# EAGLE design monster_dac (EAGLE 6.4)

## Sheet 1 of 3: DAC
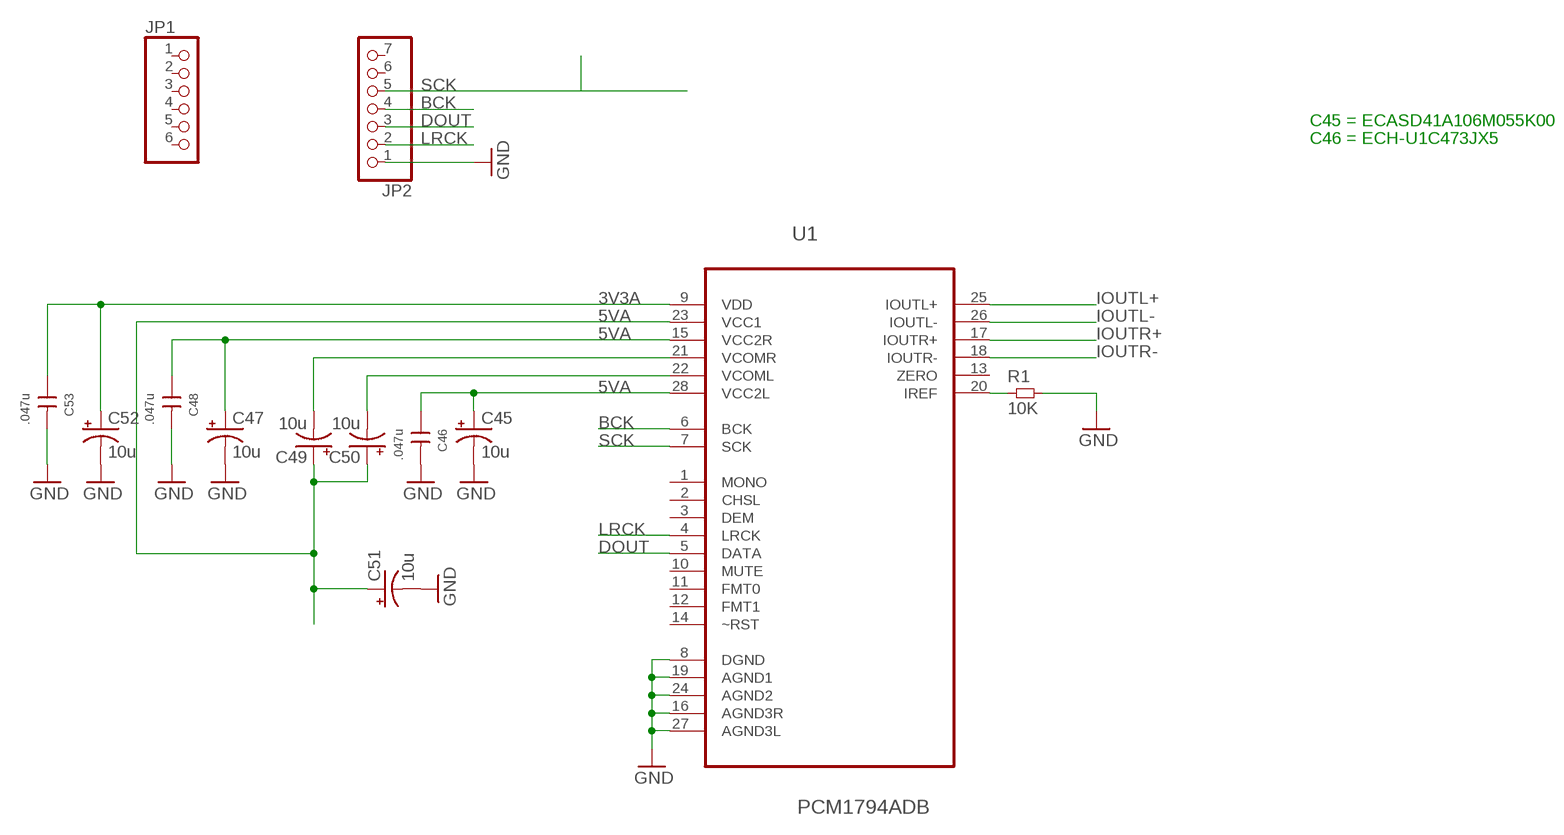
[diagram p0: schematic, sheet 1]

### Parts
C45  10u  CPOL-USE2-5  [E2-5]
C46  .047u  47NF63VMKS2  [2,5X6,5RM5,0]
C47  10u  CPOL-USE2-5  [E2-5]
C48  .047u  47NF63VMKS2  [2,5X6,5RM5,0]
C49  10u  CPOL-USE2-5  [E2-5]
C50  10u  CPOL-USE2-5  [E2-5]
C51  10u  CPOL-USE2-5  [E2-5]
C52  10u  CPOL-USE2-5  [E2-5]
C53  .047u  47NF63VMKS2  [2,5X6,5RM5,0]
JP1  PINHD-1X6  [1X06]
JP2  PINHD-1X7  [1X07]
R1  10K  RES0603L3  [0603L3]
U1  PCM1794ADB  [SOP65P780X200-28N]

### Nets
3V3A: C52.+ C53.1 U1.9(VDD)
5VA: C45.+ C46.1 C47.+ C48.1 C49.+ C50.+ C51.+ U1.15(VCC2R) U1.23(VCC1) U1.28(VCC2L)
BCK: JP2.4 U1.6(BCK)
DOUT: JP2.3 U1.5(DATA)
GND: C45.- C46.2 C47.- C48.2 C51.- C52.- C53.2 JP2.1 R1.P$2 U1.8(DGND) U1.16(AGND3R) U1.19(AGND1) U1.24(AGND2) U1.27(AGND3L) ; also sheet 2,3
IOUTL+: U1.25(IOUTL+) ; also sheet 2
IOUTL-: U1.26(IOUTL-) ; also sheet 2
IOUTR+: U1.17(IOUTR+) ; also sheet 2
IOUTR-: U1.18(IOUTR-) ; also sheet 2
LRCK: JP2.2 U1.4(LRCK)
N$2: R1.P$1 U1.20(IREF)
N$3: C50.- U1.22(VCOML)
N$4: C49.- U1.21(VCOMR)
SCK: JP2.5 U1.7(SCK)
Unconnected: JP1.1 JP1.2 JP1.3 JP1.4 JP1.5 JP1.6 JP2.6 JP2.7 U1.1(MONO) U1.2(CHSL) U1.3(DEM) U1.10(MUTE) U1.11(FMT0) U1.12(FMT1) U1.13(ZERO) U1.14(~RST)

### Notes on the sheet
- C45 = ECASD41A106M055K00
- C46 = ECH-U1C473JX5

## Sheet 2 of 3: I/V Converter
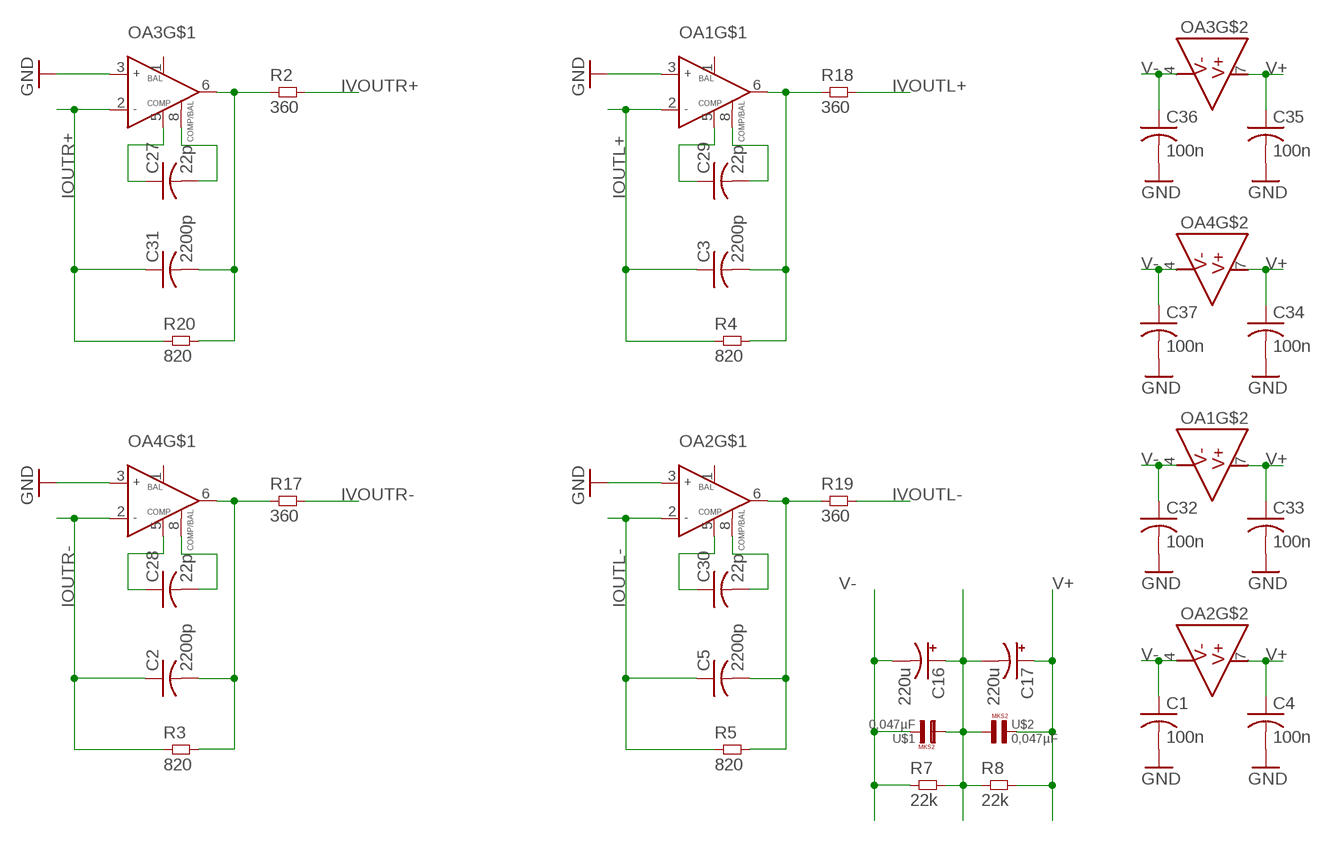
[diagram p1: schematic, sheet 2]

### Parts
C1  100n  C-USC0603  [C0603]
C2  2200p  C-USC0603  [C0603]
C3  2200p  C-USC0603  [C0603]
C4  100n  C-USC0603  [C0603]
C5  2200p  C-USC0603  [C0603]
C16  220u  CPOL-USE2.5-6  [E2,5-6]
C17  220u  CPOL-USE2.5-6  [E2,5-6]
C27  22p  C-USC0603  [C0603]
C28  22p  C-USC0603  [C0603]
C29  22p  C-USC0603  [C0603]
C30  22p  C-USC0603  [C0603]
C31  2200p  C-USC0603  [C0603]
C32  100n  C-USC0603  [C0603]
C33  100n  C-USC0603  [C0603]
C34  100n  C-USC0603  [C0603]
C35  100n  C-USC0603  [C0603]
C36  100n  C-USC0603  [C0603]
C37  100n  C-USC0603  [C0603]
OA1  NE5534ADSOIC8  [SOIC-8]
OA2  NE5534ADSOIC8  [SOIC-8]
OA3  NE5534ADSOIC8  [SOIC-8]
OA4  NE5534ADSOIC8  [SOIC-8]
R2  360  RES0603L3  [0603L3]
R3  820  RES0603L3  [0603L3]
R4  820  RES0603L3  [0603L3]
R5  820  RES0603L3  [0603L3]
R7  22k  RES0603L3  [0603L3]
R8  22k  RES0603L3  [0603L3]
R17  360  RES0603L3  [0603L3]
R18  360  RES0603L3  [0603L3]
R19  360  RES0603L3  [0603L3]
R20  820  RES0603L3  [0603L3]
U$1  0,047µF  [R5B2K5]
U$2  0,047µF  [R5B2K5]

### Nets
GND: C1.2 C4.2 C16.+ C17.- C32.2 C33.2 C34.2 C35.2 C36.2 C37.2 OA1.3(IN+) OA2.3(IN+) OA3.3(IN+) OA4.3(IN+) R7.P$2 R8.P$1 U$1.1 U$2.1 ; also sheet 1,3
IOUTL+: C3.1 OA1.2(IN-) R4.P$1 ; also sheet 1
IOUTL-: C5.1 OA2.2(IN-) R5.P$1 ; also sheet 1
IOUTR+: C31.1 OA3.2(IN-) R20.P$1 ; also sheet 1
IOUTR-: C2.1 OA4.2(IN-) R3.P$1 ; also sheet 1
IVOUTL+: R18.P$2 ; also sheet 3
IVOUTL-: R19.P$2 ; also sheet 3
IVOUTR+: R2.P$2 ; also sheet 3
IVOUTR-: R17.P$2 ; also sheet 3
N$17: C27.1 OA3.5(COMP)
N$19: C27.2 OA3.8(COMP/BAL)
N$21: C28.1 OA4.5(COMP)
N$22: C28.2 OA4.8(COMP/BAL)
N$27: C29.1 OA1.5(COMP)
N$28: C29.2 OA1.8(COMP/BAL)
N$29: C30.1 OA2.5(COMP)
N$31: C30.2 OA2.8(COMP/BAL)
N$32: C31.2 OA3.6(OUT) R2.P$1 R20.P$2
N$35: C2.2 OA4.6(OUT) R3.P$2 R17.P$1
N$36: C3.2 OA1.6(OUT) R4.P$2 R18.P$1
N$37: C5.2 OA2.6(OUT) R5.P$2 R19.P$1
V+: C4.1 C17.+ C33.1 C34.1 C35.1 OA1.7(V+) OA2.7(V+) OA3.7(V+) OA4.7(V+) R8.P$2 U$2.2 ; also sheet 3
V-: C1.1 C16.- C32.1 C36.1 C37.1 OA1.4(V-) OA2.4(V-) OA3.4(V-) OA4.4(V-) R7.P$1 U$1.2 ; also sheet 3
Unconnected: OA1.1(BAL) OA2.1(BAL) OA3.1(BAL) OA4.1(BAL)

## Sheet 3 of 3: Out Stage
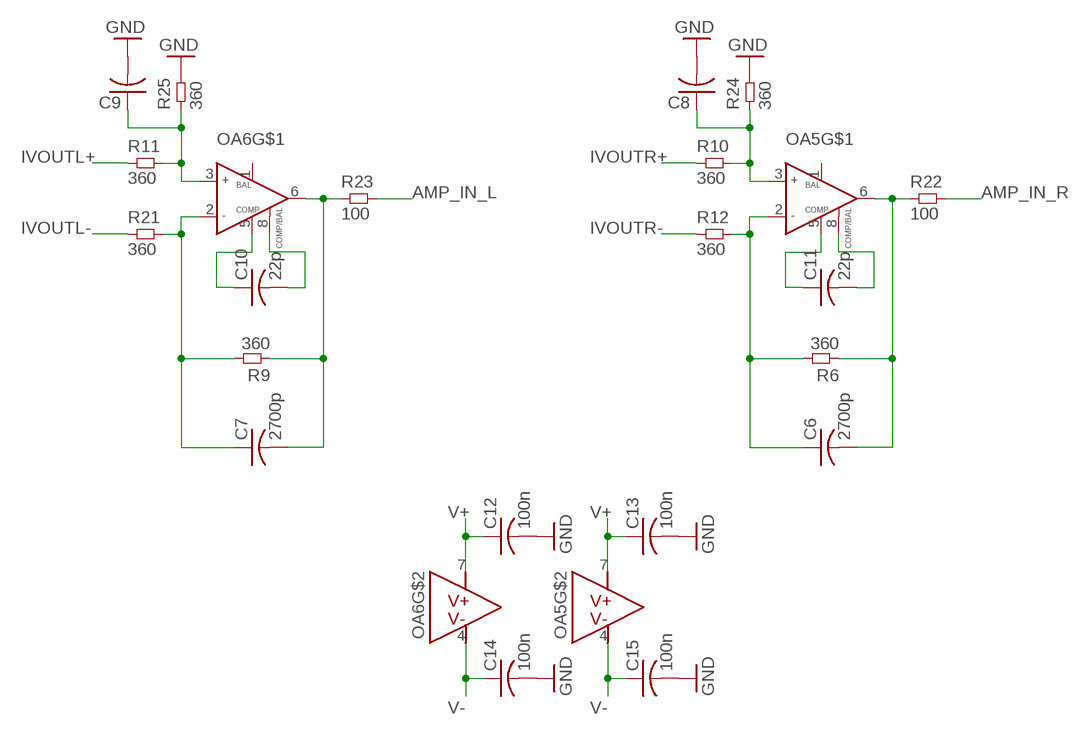
[diagram p2: schematic, sheet 3]

### Parts
C6  2700p  C-USC0603  [C0603]
C7  2700p  C-USC0603  [C0603]
C8  C-USC0603  [C0603]
C9  C-USC0603  [C0603]
C10  22p  C-USC0603  [C0603]
C11  22p  C-USC0603  [C0603]
C12  100n  C-USC0603  [C0603]
C13  100n  C-USC0603  [C0603]
C14  100n  C-USC0603  [C0603]
C15  100n  C-USC0603  [C0603]
OA5  NE5534ADSOIC8  [SOIC-8]
OA6  NE5534ADSOIC8  [SOIC-8]
R6  360  RES0603L3  [0603L3]
R9  360  RES0603L3  [0603L3]
R10  360  RES0603L3  [0603L3]
R11  360  RES0603L3  [0603L3]
R12  360  RES0603L3  [0603L3]
R21  360  RES0603L3  [0603L3]
R22  100  RES0603L3  [0603L3]
R23  100  RES0603L3  [0603L3]
R24  360  RES0603L3  [0603L3]
R25  360  RES0603L3  [0603L3]

### Nets
AMP_IN_L: R23.P$2
AMP_IN_R: R22.P$2
DIFF_L+: C9.1 OA6.3(IN+) R11.P$2 R25.P$1
DIFF_L-: C7.1 OA6.2(IN-) R9.P$2 R21.P$2
DIFF_OUT_L: C7.2 OA6.6(OUT) R9.P$1 R23.P$1
DIFF_OUT_R: C6.2 OA5.6(OUT) R6.P$1 R22.P$1
DIFF_R+: C8.1 OA5.3(IN+) R10.P$2 R24.P$1
DIFF_R-: C6.1 OA5.2(IN-) R6.P$2 R12.P$2
GND: C8.2 C9.2 C12.2 C13.2 C14.2 C15.2 R24.P$2 R25.P$2 ; also sheet 1,2
IVOUTL+: R11.P$1 ; also sheet 2
IVOUTL-: R21.P$1 ; also sheet 2
IVOUTR+: R10.P$1 ; also sheet 2
IVOUTR-: R12.P$1 ; also sheet 2
N$1: C10.1 OA6.5(COMP)
N$13: C10.2 OA6.8(COMP/BAL)
N$16: C11.1 OA5.5(COMP)
N$18: C11.2 OA5.8(COMP/BAL)
V+: C12.1 C13.1 OA5.7(V+) OA6.7(V+) ; also sheet 2
V-: C14.1 C15.1 OA5.4(V-) OA6.4(V-) ; also sheet 2
Unconnected: OA5.1(BAL) OA6.1(BAL)

## Library data of the parts
C1-C15 C27-C37 = rcl:C-US: CAPACITOR, American symbol
C16 C17 C45 C47 C49-C52 = rcl:CPOL-US: POLARIZED CAPACITOR, American symbol
C46 C48 C53 = wima_c:47NF63V
JP1 = pinhead:PINHD-1X6: PIN HEADER
JP2 = pinhead:PINHD-1X7: PIN HEADER
OA1-OA6 = common:NE5534: Low-noise, high-SP audio Op Amp.; BIAS_CURRENT: 500nA; CMRR: 100dB; GAIN_BANDWIDTH_PRODUCT: 10MHz; IN-VOL_NOISE_DENSITY: 3.5nV; OFFSET_VOL: 500uV; OUTPUT_CURRENT: 38mA; SLEW_RATE: 13V/uS; SUPPLY_CURRENT: 4mA; SUPPLY_VOL_MAX: 30V; SUPPLY_VOL_MIN: 10V
R1-R12 R17-R25 = common:RES
U1 = Texas Instruments_By_element14_Batch_1:PCM1794ADB: 24-Bit 192khz Sampling advanced segment Audio stereo digital-to-analog converter; MPN: PCM1794ADB; OC_FARNELL: 1755014; OC_NEWARK: 54K0199; PACKAGE: SSOP-28; SUPPLIER: Texas Instruments
U$1 U$2 = Capacitor-Wima-MKS2-50v:0,047µF

## Board
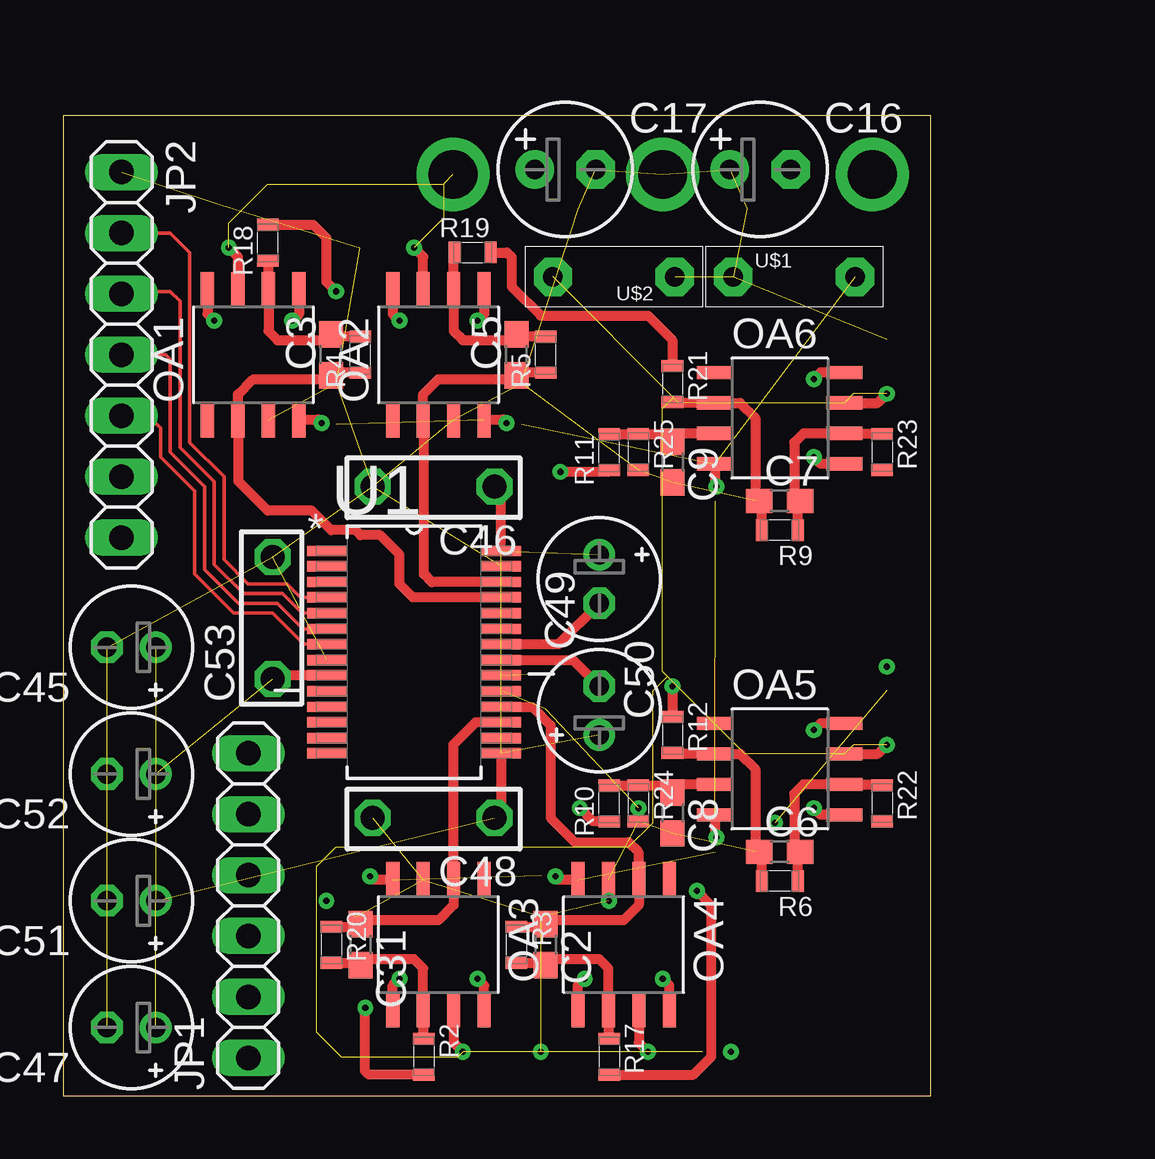
[diagram p3: board, top side]
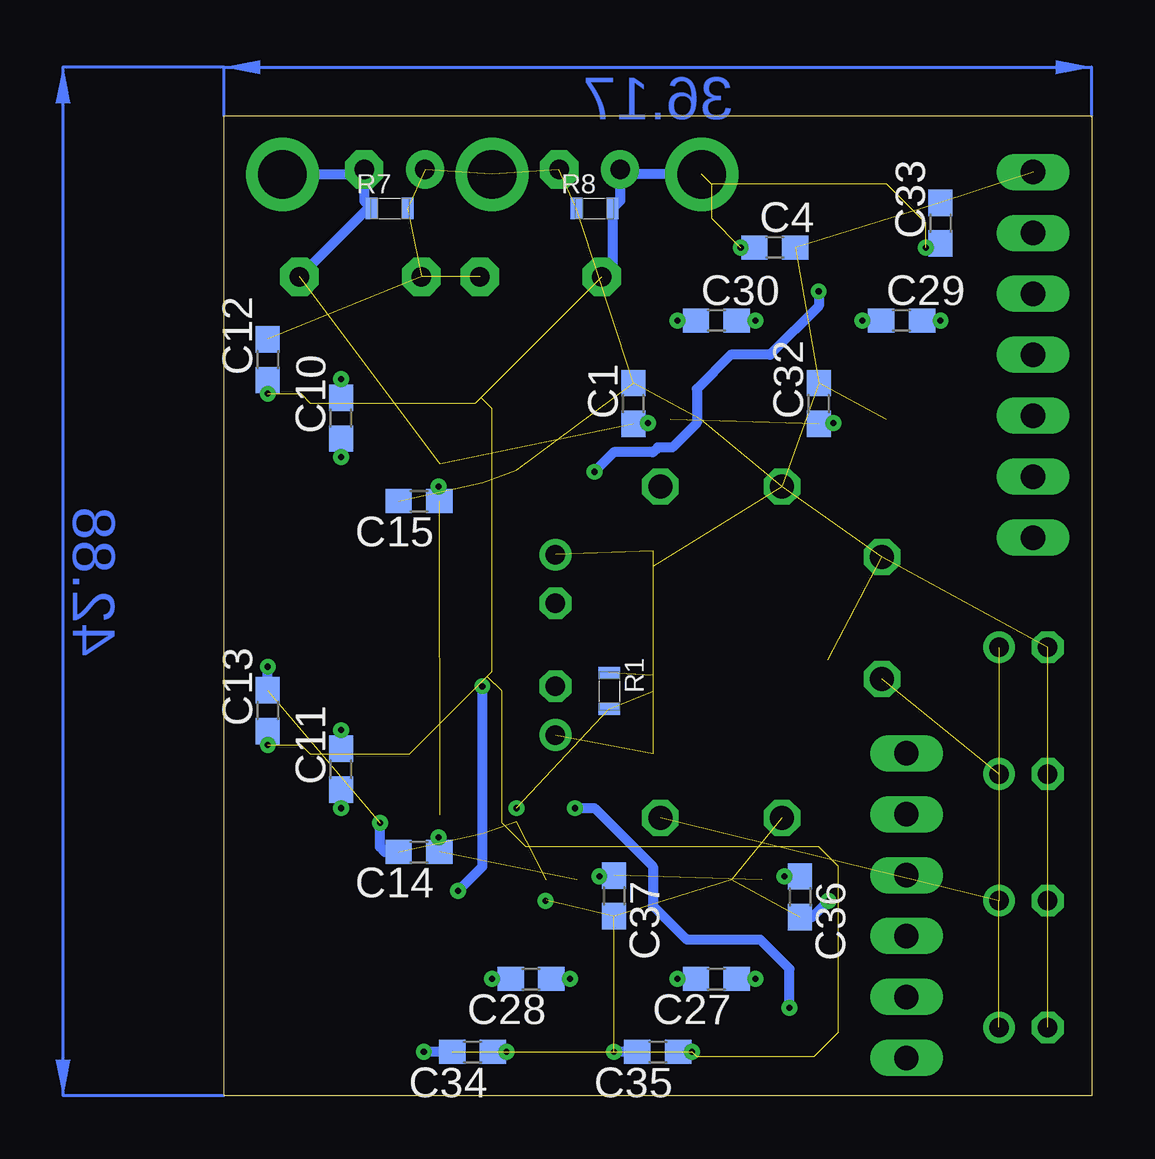
[diagram p4: board, bottom side, seen from below]

Size 36.17 x 40.84 mm. Coordinates in mm from the lower left corner, seen from the top.
Outline: 0,0 36.17,0 36.17,40.84 0,40.84 0,0
Copper layers (1*2*3*16): Top 0.035mm / dielectric 1.5mm / Route2 0.035mm / dielectric 0.15mm / Route3 0.035mm / dielectric 0.2mm / Bottom 0.035mm
Design rules "default *": minimum track width 10mil, minimum drill 24mil, track to track 8mil, track to pad 8mil, pad to pad 8mil, via to via 8mil, smd to smd 8mil, copper to edge 13mil, drill to drill 8mil, minimum pad ring 10mil, minimum via ring 8mil, stop-mask expansion 4mil, vias tented up to drill 0mil, thermal gap 10mil

### Footprints (pad centres in the part's own frame; a part is rotated, then mirrored left to right if it is on the bottom)
C0603 = smd 1.1 x 1: 1 -0.85,0; 2 0.85,0
E2,5-6 = drill 0.813 pad 1.6: + -1.27,0 | drill 0.813 pad 1.6 octagon: - 1.27,0
E2-5 = drill 0.813 pad 1.27: + -1.016,0 | drill 0.813 pad 1.27 octagon: - 1.016,0
2,5X6,5RM5,0 = drill 1 pad 1.5 octagon: 1 -2.54,0; 2 2.54,0
1X06 = drill 1.016 long: 1 -6.35,0; 2 -3.81,0; 3 -1.27,0; 4 1.27,0; 5 3.81,0; 6 6.35,0
1X07 = drill 1.016 long: 1 -7.62,0; 2 -5.08,0; 3 -2.54,0; 4 0,0; 5 2.54,0; 6 5.08,0; 7 7.62,0
SOIC-8 = smd 0.55 x 1.5: 1 -1.905,-2.7; 2 -0.635,-2.7; 3 0.635,-2.7; 4 1.905,-2.7; 5 1.905,2.7; 6 0.635,2.7; 7 -0.635,2.7; 8 -1.905,2.7
0603L3 = smd 0.5 x 0.9: P$1 -0.75,0; P$2 0.75,0
SOP65P780X200-28N = smd 1.651 x 0.432: 1 -3.632,4.216; 2 -3.632,3.581; 3 -3.632,2.921; 4 -3.632,2.286; 5 -3.632,1.626; 6 -3.632,0.965; 7 -3.632,0.33; 8 -3.632,-0.33; 9 -3.632,-0.965; 10 -3.632,-1.626; 11 -3.632,-2.286; 12 -3.632,-2.921; 13 -3.632,-3.581; 14 -3.632,-4.216; 15 3.632,-4.216; 16 3.632,-3.581; 17 3.632,-2.921; 18 3.632,-2.286; 19 3.632,-1.626; 20 3.632,-0.965; 21 3.632,-0.33; 22 3.632,0.33; 23 3.632,0.965; 24 3.632,1.626; 25 3.632,2.286; 26 3.632,2.921; 27 3.632,3.581; 28 3.632,4.216
R5B2K5 = drill 0.813 pad 1.6 octagon: 1 -2.54,0; 2 2.54,0

### Placement (x,y rotation side)
C1  19.1,28.85 90 bottom
C2  20.12,6.3 270 top
C3  11.18,30.89 90 top
C4  13.21,35.36 0 bottom
C5  18.9,30.89 90 top
C6  29.87,10.16 0 top
C7  29.87,24.79 0 top
C8  25.4,11.79 270 top
C9  25.4,26.42 270 top
C10  31.29,28.24 90 bottom
C11  31.29,13.61 90 bottom
C12  34.34,30.68 90 bottom
C13  34.34,16.05 90 bottom
C14  28.04,10.16 180 bottom
C15  28.04,24.79 180 bottom
C16  29.06,38.61 0 top
C17  20.93,38.61 0 top
C27  15.65,4.88 180 bottom
C28  23.37,4.88 180 bottom
C29  7.92,32.31 0 bottom
C30  15.65,32.31 0 bottom
C31  12.4,6.3 270 top
C32  11.38,28.85 90 bottom
C33  6.3,36.37 90 bottom
C34  25.81,1.83 180 bottom
C35  18.08,1.83 180 bottom
C36  12.16,8.29 270 bottom
C37  19.91,8.33 270 bottom
C45  2.84,18.69 180 top
C46  15.44,25.4 180 top
C47  2.84,2.84 180 top
C48  15.44,11.58 180 top
C49  22.35,16.05 90 top
C50  22.35,21.54 270 top
C51  2.84,8.13 180 top
C52  2.84,13.41 180 top
C53  8.74,19.91 90 top
JP1  7.72,7.92 90 top
JP2  2.44,30.89 270 top
OA1  7.92,30.89 0 top
OA2  15.65,30.89 0 top
OA3  15.65,6.3 180 top
OA4  23.37,6.3 180 top
OA5  29.87,13.61 270 top
OA6  29.87,28.24 270 top
R1  20.12,16.87 270 bottom
R2  15.04,1.63 270 top
R3  18.9,6.3 270 top
R4  12.4,30.89 90 top
R5  20.12,30.89 90 top
R6  29.87,8.94 180 top
R7  29.26,36.98 0 bottom
R8  20.73,36.98 0 bottom
R9  29.87,23.57 180 top
R10  22.76,12.19 90 top
R11  22.76,26.82 90 top
R12  25.4,15.04 270 top
R17  22.76,1.63 270 top
R18  8.53,35.56 90 top
R19  17.07,35.15 0 top
R20  11.18,6.3 270 top
R21  25.4,29.67 270 top
R22  34.14,12.19 270 top
R23  34.14,26.82 270 top
R24  23.98,12.19 270 top
R25  23.98,26.82 270 top
U1  14.63,18.49 0 top
U$1  30.48,34.14 0 top
U$2  22.96,34.14 180 top

### Tracks (layer width: path | path; a pad name or v marks a point on that pad's centre or on a via)
3V3A  (1 unrouted)
  Top 0.406: U1.9 8.89,17.53 C53.1
5VA  (7 unrouted)
  Top 0.406: U1.28 18.26,25.12 C46.1 | U1.15 18.26,11.86 C48.1
BCK
  Top 0.152: U1.6 10.01,19.46 8.94,20.52 7.32,20.52 5.89,21.95 5.89,25.4 4.47,26.82 4.47,30.68 4.27,30.89 JP2.4
DIFF_L+
  Top 0.406: OA6.3 25.74,27.61 C9.1 25.09,27.57 R25.P$1 R11.P$2
DIFF_L-
  Top 0.406: R21.P$2 25.44,28.88 OA6.2 28.22,28.88 28.85,28.24 28.85,24.96 C7.1 29.12,24.69 R9.P$2
DIFF_OUT_L
  Top 0.406: R23.P$1 33.97,27.61 OA6.6 30.86,27.61 30.48,27.23 30.48,25.03 C7.2 30.62,24.69 R9.P$1
DIFF_OUT_R
  Top 0.406: R22.P$1 33.97,12.98 OA5.6 30.86,12.98 30.48,12.6 30.48,10.4 C6.2 30.62,10.06 R6.P$1
DIFF_R+
  Top 0.406: OA5.3 25.74,12.98 C8.1 25.09,12.94 R24.P$1 R10.P$2
DIFF_R-
  Top 0.406: R6.P$2 29.12,10.06 C6.1 28.85,10.33 28.85,13.61 28.22,14.25 OA5.2 25.44,14.25 R12.P$2
DOUT
  Top 0.152: U1.5 9.96,20.12 9.14,20.93 7.52,20.93 6.3,22.15 6.3,25.6 4.88,27.03 4.88,33.12 4.47,33.53 2.54,33.53 JP2.3
GND  (via drill 0.25, 2.03)  (40 unrouted)
  Top 0.406: OA4.3 22.73,8.15 v22.76,8.13 | R24.P$2 v23.98,11.99
  Bottom 0.406: C35.2 v19.91,1.83 | C34.2 v27.84,1.83 | C14.2 29.46,10.16 29.67,10.36 v29.67,11.38 | C13.2 v34.34,17.88 | C36.2 11.66,7.44 v10.97,8.13
  other vias: 24.99,38.4
IOUTL+
  Top 0.406: R4.P$1 11.28,30.14 C3.1 11.01,29.87 7.92,29.87 7.29,29.24 OA1.2 7.32,28.16 7.32,25.6 8.53,24.38 10.36,24.38 11.18,23.57 12.19,23.57 12.4,23.37 13.21,23.37 14.02,22.56 14.02,21.34 14.58,20.78 U1.25
IOUTL-
  Top 0.406: R5.P$1 19,30.14 C5.1 18.73,29.87 15.65,29.87 15.01,29.24 OA2.2 15.04,28.16 15.04,21.74 15.37,21.41 U1.26
IOUTR+
  Top 0.406: R20.P$1 12.3,7.05 C31.1 12.55,7.32 15.65,7.32 16.28,7.95 OA3.2 16.26,9.02 16.26,14.63 17.2,15.57 U1.17
IOUTR-
  Top 0.406: R3.P$1 20.02,7.05 C2.1 20.28,7.32 23.37,7.32 24,7.95 OA4.2 23.98,9.02 23.98,10.16 23.57,10.57 21.34,10.57 20.32,11.58 20.32,15.44 19.56,16.21 U1.18
IVOUTL+  (via drill 0.25)
  Top 0.406: R18.P$2 10.43,36.31 10.97,35.76 10.97,33.93 v11.38,33.53 | v20.73,26.01 22.7,26.01 R11.P$1
  Bottom 0.406: v11.38,33.53 11.38,32.92 13.41,30.89 15.04,30.89 16.46,29.46 16.46,28.04 17.48,27.03 18.08,27.03 18.29,26.82 19.91,26.82 v20.73,26.01
IVOUTL-
  Top 0.406: R21.P$1 25.4,31.5 24.38,32.51 19.91,32.51 18.69,33.73 18.69,34.95 18.49,35.15 R19.P$2
IVOUTR+  (via drill 0.25)
  Top 0.406: R10.P$1 22.09,11.44 v21.54,11.99 | R2.P$2 12.74,0.88 12.6,1.02 v12.6,3.66
  Bottom 0.406: v21.54,11.99 20.73,11.99 18.29,9.55 18.29,7.92 16.87,6.5 13.82,6.5 12.6,5.28 v12.6,3.66
IVOUTR-  (via drill 0.25)
  Top 0.406: R17.P$2 26.28,0.88 27.03,1.63 27.03,7.92 v26.42,8.53 | v25.4,17.07 R12.P$1
  Bottom 0.406: v26.42,8.53 25.4,9.55 v25.4,17.07
LRCK
  Top 0.152: U1.4 9.91,20.78 9.35,21.34 7.72,21.34 6.71,22.35 6.71,25.81 5.28,27.23 5.28,35.15 4.47,35.97 JP2.2
N$1  (via drill 0.25)
  Top 0.406: OA6.5 31.57,26.34 v31.29,26.62
  Bottom 0.406: C10.1 v31.29,26.62
N$2  (1 unrouted)
N$3
  Top 0.406: U1.22 20.65,18.82 C50.-
N$4
  Top 0.406: U1.21 21.26,18.16 C49.-
N$13  (via drill 0.25)
  Top 0.406: OA6.8 31.57,30.15 v31.29,29.87
  Bottom 0.406: C10.2 v31.29,29.87
N$16  (via drill 0.25)
  Top 0.406: OA5.5 31.57,11.71 v31.29,11.99
  Bottom 0.406: C11.1 v31.29,11.99
N$17  (via drill 0.25)
  Top 0.406: OA3.5 13.74,4.6 v14.02,4.88
  Bottom 0.406: C27.1 v14.02,4.88
N$18  (via drill 0.25)
  Top 0.406: OA5.8 31.57,15.52 v31.29,15.24
  Bottom 0.406: C11.2 v31.29,15.24
N$19  (via drill 0.25)
  Top 0.406: OA3.8 17.55,4.6 v17.27,4.88
  Bottom 0.406: C27.2 v17.27,4.88
N$21  (via drill 0.25)
  Top 0.406: OA4.5 21.46,4.6 v21.74,4.88
  Bottom 0.406: C28.1 v21.74,4.88
N$22  (via drill 0.25)
  Top 0.406: OA4.8 25.27,4.6 v24.99,4.88
  Bottom 0.406: C28.2 v24.99,4.88
N$27  (via drill 0.25)
  Top 0.406: OA1.5 9.83,32.59 v9.55,32.31
  Bottom 0.406: C29.1 v9.55,32.31
N$28  (via drill 0.25)
  Top 0.406: OA1.8 6.02,32.59 v6.3,32.31
  Bottom 0.406: C29.2 v6.3,32.31
N$29  (via drill 0.25)
  Top 0.406: OA2.5 17.55,32.59 v17.27,32.31
  Bottom 0.406: C30.1 v17.27,32.31
N$31  (via drill 0.25)
  Top 0.406: OA2.8 13.74,32.59 v14.02,32.31
  Bottom 0.406: C30.2 v14.02,32.31
N$32
  Top 0.406: R2.P$1 15.01,2.4 OA3.6 15.01,5.31 14.63,5.69 12.63,5.69 C31.2 12.3,5.55 R20.P$2
N$35
  Top 0.406: R3.P$2 20.02,5.55 C2.2 20.36,5.69 22.35,5.69 22.73,5.31 OA4.6 22.73,2.4 R17.P$1
N$36
  Top 0.406: R18.P$1 8.56,34.78 OA1.6 8.56,31.88 8.94,31.5 10.94,31.5 C3.2 11.28,31.64 R4.P$2
N$37
  Top 0.406: R5.P$2 19,31.64 C5.2 18.66,31.5 16.66,31.5 16.28,31.88 OA2.6 16.28,34.78 R19.P$1
SCK
  Top 0.152: U1.7 10.03,18.82 8.74,20.12 7.11,20.12 5.49,21.74 5.49,25.2 4.06,26.62 4.06,27.84 3.66,28.24 2.54,28.24 JP2.5
V+  (via drill 0.25, 2.03)  (28 unrouted)
  Top 0.406: OA1.7 7.29,34.98 v6.91,35.36 | OA2.7 15.01,34.98 v14.63,35.36 | OA4.7 24,2.21 v24.38,1.83 | OA3.7 16.28,2.21 v16.66,1.83 | OA6.7 33.96,28.88 v34.34,29.26 | OA5.7 33.96,14.25 v34.34,14.63
  Bottom 0.406: C33.1 v6.91,35.36 | C4.1 v14.63,35.36 | C12.1 v34.34,29.26 | C13.1 v34.34,14.63 | C34.1 v24.38,1.83 | C35.1 v16.66,1.83 | U$2.2 19.98,34.58 R8.P$2 19.66,37.3 C17.+ 19.46,38.4 v16.26,38.4
V-  (via drill 0.25, 2.03)  (6 unrouted)
  Top 0.406: OA2.4 18.35,28.19 v18.49,28.04 | OA1.4 10.62,28.19 v10.77,28.04 | OA6.4 27.17,25.46 v27.23,25.4 | OA5.4 27.17,10.83 v27.23,10.77 | OA3.4 12.95,9 v12.8,9.14 | OA4.4 20.67,9 v20.52,9.14
  Bottom 0.406: C15.1 27.19,25.36 v27.23,25.4 | C1.1 18.53,28 v18.49,28.04 | C32.1 10.81,28 v10.77,28.04 | C36.1 v12.8,9.14 | C37.1 20.49,9.18 v20.52,9.14 | C14.1 27.19,10.73 v27.23,10.77 | v33.73,38.4 30.53,38.4 C16.- 30.33,37.3 R7.P$1 30.18,36.98 U$1.2
(copper drawn outside any net)
  shapes: Bottom area x2